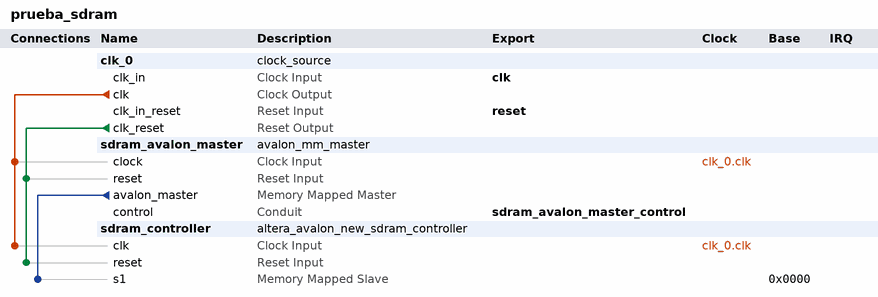
[diagram p0: system contents]
# Platform Designer (Qsys) system prueba_sdram, Cyclone IV GX EP4CGX150DF31C7
# Parameters at their usual value, and those the tool derives, are not listed.
package require -exact qsys 15.1
create_system prueba_sdram
set_project_property DEVICE_FAMILY {Cyclone IV GX}
set_project_property DEVICE EP4CGX150DF31C7

add_instance clk_0 clock_source 15.1
set_instance_parameter_value clk_0 clockFrequency 50000000

add_instance sdram_avalon_master avalon_mm_master 1.0
set_instance_parameter_value sdram_avalon_master ADDRESS_BITS 23
set_instance_parameter_value sdram_avalon_master DATA_BITS 32

add_instance sdram_controller altera_avalon_new_sdram_controller 15.1
set_instance_parameter_value sdram_controller TAC 5.5
set_instance_parameter_value sdram_controller TRCD 20.0
set_instance_parameter_value sdram_controller TRP 20.0
set_instance_parameter_value sdram_controller casLatency 3
set_instance_parameter_value sdram_controller columnWidth 8
set_instance_parameter_value sdram_controller dataWidth 32
set_instance_parameter_value sdram_controller generateSimulationModel true
set_instance_parameter_value sdram_controller model single_Micron_MT48LC4M32B2_7_chip
set_instance_parameter_value sdram_controller numberOfBanks 4
set_instance_parameter_value sdram_controller numberOfChipSelects 1
set_instance_parameter_value sdram_controller powerUpDelay 100.0
set_instance_parameter_value sdram_controller refreshPeriod 15.625
set_instance_parameter_value sdram_controller rowWidth 11

# connections
add_connection clk_0.clk sdram_avalon_master.clock clock
add_connection clk_0.clk sdram_controller.clk clock
add_connection clk_0.clk_reset sdram_avalon_master.reset reset
add_connection clk_0.clk_reset sdram_controller.reset reset
add_connection sdram_avalon_master.avalon_master sdram_controller.s1 avalon
set_connection_parameter_value sdram_avalon_master.avalon_master/sdram_controller.s1 baseAddress 0x0000

# exported interfaces
add_interface clk clock sink
set_interface_property clk EXPORT_OF clk_0.clk_in
add_interface reset reset sink
set_interface_property reset EXPORT_OF clk_0.clk_in_reset
add_interface sdram_avalon_master_control conduit end
set_interface_property sdram_avalon_master_control EXPORT_OF sdram_avalon_master.control

set_interconnect_requirement {$system} qsys_mm.clockCrossingAdapter HANDSHAKE
set_interconnect_requirement {$system} qsys_mm.enableEccProtection FALSE
set_interconnect_requirement {$system} qsys_mm.insertDefaultSlave FALSE
set_interconnect_requirement {$system} qsys_mm.maxAdditionalLatency 1

save_system prueba_sdram.qsys
